# Altium schematic sheet 开关部分.SchDoc
size A2
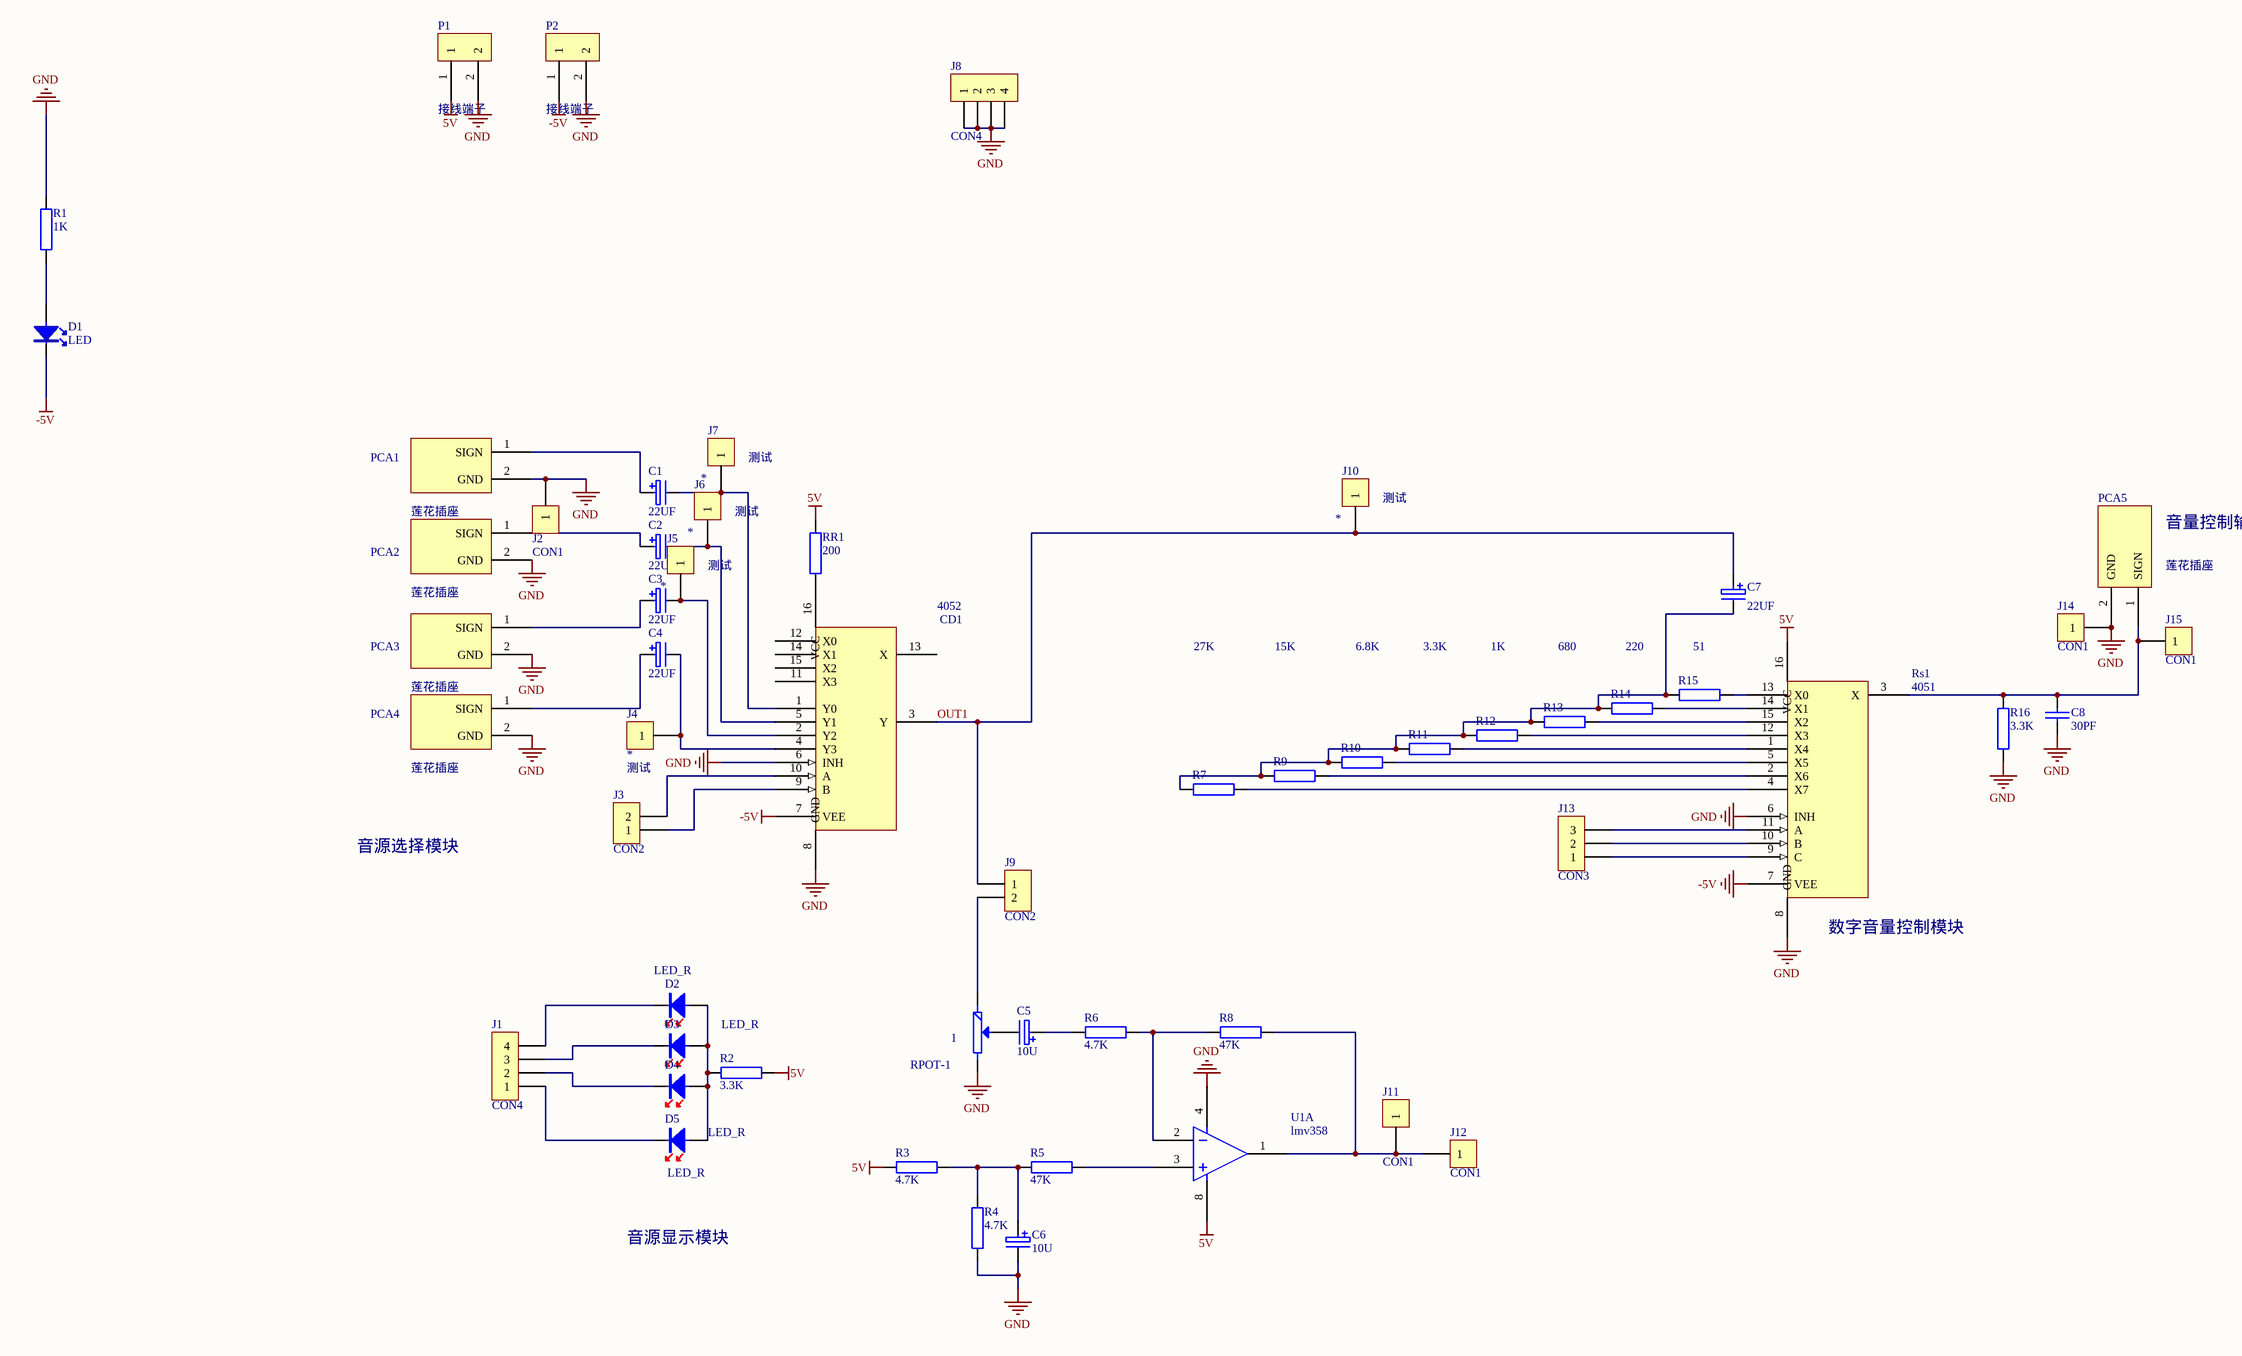
[diagram p0: 开关部分.SchDoc]

## Parts
1  RPOT-1  [RVR-2]
C1  22UF  [CAO2]
C2  22UF  [CAO2]
C3  22UF  [CAO2]
C4  22UF  [CAO2]
C5  10U  [CAO1]
C6  10U  [CAO1]
C7  22UF  [CAO2]
C8  30PF  [CAP2]
CD1  4052  [SO-16]
D1  LED  [LED2_B]
D2  LED_R  [LED2_B]
D3  LED_R  [LED2_B]
D4  LED_R  [LED2_B]
D5  LED_R  [LED2_B]
J1  CON4  [sip-4]
J2  CON1  [SIP-1]
J3  CON2  [sip-2]
J4  *  [SIP-1]
J5  *  [SIP-1]
J6  *  [SIP-1]
J7  *  [SIP-1]
J8  CON4  [sip-4]
J9  CON2  [sip-2]
J10  *  [SIP-1]
J11  CON1  [SIP-1]
J12  CON1  [SIP-1]
J13  CON3  [sip-3]
J14  CON1  [SIP-1]
J15  CON1  [SIP-1]
P1  接线端子  [接线端子]
P2  接线端子  [接线端子]
PCA1  莲花插座  [莲花母座]
PCA2  莲花插座  [莲花母座]
PCA3  莲花插座  [莲花母座]
PCA4  莲花插座  [莲花母座]
PCA5  莲花插座  [莲花母座]
R1  1K  [AXIAL0.4]
R2  3.3K  [AXIAL0.4]
R3  4.7K  [AXIAL0.4]
R4  4.7K  [AXIAL0.4]
R5  47K  [AXIAL0.4]
R6  4.7K  [AXIAL0.4]
R7  27K  [AXIAL0.4]
R8  47K  [AXIAL0.4]
R9  15K  [AXIAL0.4]
R10  6.8K  [AXIAL0.4]
R11  3.3K  [AXIAL0.4]
R12  1K  [AXIAL0.4]
R13  680  [AXIAL0.4]
R14  220  [AXIAL0.4]
R15  51  [AXIAL0.4]
R16  3.3K  [AXIAL0.4]
RR1  200  [AXIAL0.4]
Rs1  4051  [SO-16]
U1  lmv358  [SOP8]  (part A of 2)

## Nets
5V: P1.1 R2.1 R3.1 RR1.1 Rs1.16(VCC) U1.8
-5V: CD1.7(VEE) D1.2 P2.1 Rs1.7(VEE)
GND: 1.3 C6.2 C8.2 CD1.6(INH) CD1.8(GND) J2.1 J8.1 J8.2 J8.3 J8.4 J14.1 P1.2 P2.2 PCA1.2(GND) PCA2.2(GND) PCA3.2(GND) PCA4.2(GND) PCA5.2(GND) R1.2 R4.1 R16.1 Rs1.6(INH) Rs1.8(GND) U1.4
OUT1: C7.1 CD1.3(Y) J9.1 J10.1
Net1_1: 1.1 J9.2
Net1_2: 1.2(M) C5.2
NetC1_1: C1.1 PCA1.1(SIGN)
NetC1_2: C1.2 CD1.1(Y0) J7.1
NetC2_1: C2.1 PCA2.1(SIGN)
NetC2_2: C2.2 CD1.5(Y1) J6.1
NetC3_1: C3.1 PCA3.1(SIGN)
NetC3_2: C3.2 CD1.2(Y2) J5.1
NetC4_1: C4.1 PCA4.1(SIGN)
NetC4_2: C4.2 CD1.4(Y3) J4.1
NetC5_1: C5.1 R6.1
NetC6_1: C6.1 R3.2 R4.2 R5.1
NetC7_2: C7.2 R7.1 R9.1 R10.1 R11.1 R12.1 R13.1 R14.1 R15.1
NetC8_1: C8.1 J15.1 PCA5.1(SIGN) R16.2 Rs1.3(X)
NetCD1_9: CD1.9(B) J3.1
NetCD1_10: CD1.10(A) J3.2
NetCD1_16: CD1.16(VCC) RR1.2
NetD1_1: D1.1 R1.1
NetD2_1: D2.1 D3.1 D4.1 D5.1 R2.2
NetD2_2: D2.2 J1.4
NetD3_2: D3.2 J1.3
NetD4_2: D4.2 J1.2
NetD5_2: D5.2 J1.1
NetJ11_1: J11.1 J12.1 R8.2 U1.1
NetJ13_1: J13.1 Rs1.9(C)
NetJ13_2: J13.2 Rs1.10(B)
NetJ13_3: J13.3 Rs1.11(A)
NetR5_2: R5.2 U1.3
NetR6_2: R6.2 R8.1 U1.2
NetR7_2: R7.2 Rs1.4(X7)
NetR9_2: R9.2 Rs1.2(X6)
NetR10_2: R10.2 Rs1.5(X5)
NetR11_2: R11.2 Rs1.1(X4)
NetR12_2: R12.2 Rs1.12(X3)
NetR13_2: R13.2 Rs1.15(X2)
NetR14_2: R14.2 Rs1.14(X1)
NetR15_2: R15.2 Rs1.13(X0)

Not connected (* = marked no-connect by the designer): CD1 11(X3) 12(X0) 13(X) 14(X1) 15(X2)

## Notes on the sheet
- 音量控制输出
- 音源选择模块
- (near Rs1) 数字音量控制模块
- 音源显示模块

## Library data of the parts
1 = RPOT-1: 普通电位器
C1-C7 = CAP3
C8 = CAP1
J1 J8 = CON4: Connector
J2 J4-J7 J10-J12 J14 J15 = CON1: Connector
  J4-J7 J10: 测试: 测试
J3 J9 = CON2: Connector
J13 = CON3: Connector
PCA1-PCA5 = PCA
R1-R16 RR1 = RES: 电阻
U1 = NE5532: OPA2134: The OPA134 series are ultra-low distortion, low noise  operational amplifiers fully specified for audio appli-  cations. A true FET input stage was incorporated to  provide superior sound quality and speed for excep-  tional audio performance.